# EAGLE design BFFL (EAGLE 6.5.0)
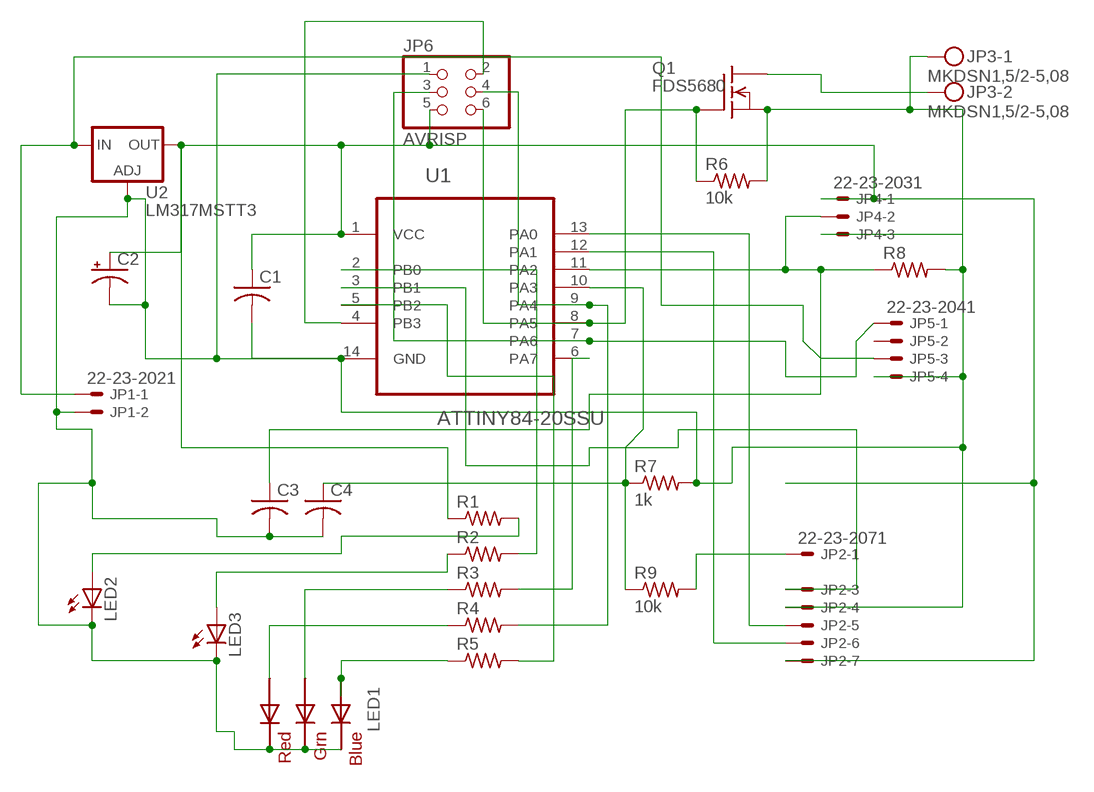
[diagram p0: schematic, sheet 1]

## Parts
C1  C-USC1206K  [C1206K]
C2  CPOL-USC/6032-28W  [C/6032-28W]
C3  C-USC1206K  [C1206K]
C4  C-USC1206K  [C1206K]
JP1  22-23-2021  [22-23-2021]
JP2  22-23-2071  [22-23-2071]
JP3  MKDSN1,5/2-5,08  [MKDSN1,5/2-5,08]
JP4  22-23-2031  [22-23-2031]
JP5  22-23-2041  [22-23-2041]
JP6  AVRISP  PINHD-2X3  [2X03]
LED1  RGBLED5050  [RGBLED5050]
LED2  LEDCHIPLED_1206  [CHIPLED_1206]
LED3  LEDCHIPLED_1206  [CHIPLED_1206]
Q1  FDS5680  [SO-8]
R1  R-US_R1206  [R1206]
R2  R-US_R1206  [R1206]
R3  R-US_R1206  [R1206]
R4  R-US_R1206  [R1206]
R5  R-US_R1206  [R1206]
R6  10k  R-US_R1206  [R1206]
R7  1k  R-US_R1206  [R1206]
R8  R-US_R1206  [R1206]
R9  10k  R-US_R1206  [R1206]
U1  ATTINY84-20SSU  [SOIC127P600X175-14N]
U2  LM317MSTT3  [SOT223]

## Nets
N$1: JP2.1 R9.2
N$2: C4.1 R7.1 R9.1 U1.10(PA3)
N$3: JP1.1 JP5.3 U2.3(IN)
N$4: JP6.6 Q1.4(G) R6.1 U1.8(PA5)
N$5: R2.2 U1.2(PB0)
N$6: C1.1 C2.+ JP2.7 JP4.1 JP6.5 R1.1 U1.1(VCC) U2.4(OUT)
N$7: LED2.A R1.2
N$8: LED3.A R2.1
N$9: LED1.2(RED_A) R4.1
N$10: LED1.1(GREEN_A) R3.1
N$11: LED1.3(BLUE_A) R5.1
N$12: JP3.2 Q1.5(D) Q1.6(D) Q1.7(D) Q1.8(D)
N$13: C1.2 C2.- C3.2 C4.2 JP1.2 JP2.4 JP3.1 JP4.3 JP5.4 JP6.1 LED1.4(BLUE_C) LED1.5(RED_C) LED1.6(GREEN_C) LED2.C LED3.C Q1.1(S) Q1.2(S) Q1.3(S) R6.2 R7.2 R8.2 U1.14(GND) U2.1(ADJ)
N$14: R5.2 U1.5(PB2)
N$15: R3.2 U1.6(PA7)
N$16: JP5.1 JP6.3 U1.7(PA6)
N$17: JP2.3 U1.3(PB1)
N$18: JP6.4 R4.2 U1.9(PA4)
N$19: C3.1 JP4.2 R8.1 U1.11(PA2)
N$21: JP2.5 U1.13(PA0)
N$22: JP2.6 U1.12(PA1)
N$24: JP6.2 U1.4(PB3)
Unconnected: JP2.2 JP5.2

## Library data of the parts
C1 C3 C4 = rcl:C-US: CAPACITOR, American symbol
C2 = rcl:CPOL-US: POLARIZED CAPACITOR, American symbol
JP1 = con-molex:22-23-2021: .100" (2.54mm) Center Header - 2 Pin; MF: MOLEX; MPN: 22-23-2021; OC_FARNELL: 1462926; OC_NEWARK: 25C3832
JP2 = con-molex:22-23-2071: .100" (2.54mm) Center Header - 7 Pin; MF: MOLEX; MPN: 22-23-2071; OC_FARNELL: 1654534; OC_NEWARK: 56H0445
JP3 = con-phoenix-508:MKDSN1,5/2-5,08: MKDSN 1,5/ 2-5,08 Printklemme Nennstrom: 13,5 A Nennspannung: 250 V Rastermaß: 5,08 mm Polzahl: 2 Anschlussart: Schraubanschluss Montage: Löten Anschlussrichtung Leiter/Platine: 0 ° Artikelnummer: 1729128 Source: http://eshop.phoenixcontact.com .. 1729128.pdf; MPN: MKDSN 1,5/2-5.08; OC_FARNELL: 1792903; OC_NEWARK: 30M2397
JP4 = con-molex:22-23-2031: .100" (2.54mm) Center Header - 3 Pin; MF: MOLEX; MPN: 22-23-2031; OC_FARNELL: 1462950; OC_NEWARK: 30C0862
JP5 = con-molex:22-23-2041: .100" (2.54mm) Center Header - 4 Pin; MF: MOLEX; MPN: 22-23-2041; OC_FARNELL: 1462920; OC_NEWARK: 38C0355
JP6 = pinhead:PINHD-2X3: PIN HEADER
LED1 = adafruit:RGBLED: For 5050 RGB LEDs, the order of the LEDs may vary from one manufacturer to another!
LED2 LED3 = led:LED: LED OSRAM: - CHIPLED LG R971, LG N971, LY N971, LG Q971, LY Q971, LO R971, LY R971 LH N974, LH R974 LS Q976, LO Q976, LY Q976 LO Q996 - Hyper CHIPLED LW Q18S LB Q993, LB Q99A, LB R99A - SideLED LS A670, LO A670, LY A670, LG A670, LP A670 LB A673, LV A673, LT A673, LW A673 LH A674 LY A675 LS A676, LA A676, LO A676, LY A676, LW A676 LS A679, LY A679, LG A679 - Hyper Micro SIDELED® LS Y876, LA Y876, LO Y876, LY Y876 LT Y87S - SmartLED LW L88C, LW L88S LB L89C, LB L89S, LG L890 LS L89K, LO L89K, LY L89K LS L896, LA L896, LO L896, LY L896 - TOPLED LS T670, LO T670, LY T670, LG T670, LP T670 LSG T670, LSP T670, LSY T670, LOP T670, LYG T670 LG T671, LOG T671, LSG T671 LB T673, LV T673, LT T673, LW T673 LH T674 LS T676, LA T676, LO T676, LY T676, LB T676, LH T676, LSB T676, LW T676 LB T67C, LV T67C, LT T67C, LS T67K, LO T67K, LY T67K, LW E67C LS E67B, LA E67B, LO E67B, LY E67B, LB E67C, LV E67C, LT E67C LW T67C LS T679, LY T679, LG T679 LS T770, LO T770, LY T770, LG T770, LP T770 LB T773, LV T773, LT T773, LW T773 LH T774 LS E675, LA E675, LY E675, LS T675 LS T776, LA T776, LO T776, LY T776, LB T776 LHGB T686 LT T68C, LB T68C - Hyper Mini TOPLED® LB M676 - Mini TOPLED Santana® LG M470 LS M47K, LO M47K, LY M47K Source: http://www.osram.convergy.de LUXEON: - LUMILED® LXK2-PW12-R00, LXK2-PW12-S00, LXK2-PW14-U00, LXK2-PW14-V00 LXK2-PM12-R00, LXK2-PM12-S00, LXK2-PM14-U00 LXK2-PE12-Q00, LXK2-PE12-R00, LXK2-PE12-S00, LXK2-PE14-T00, LXK2-PE14-U00 LXK2-PB12-K00, LXK2-PB12-L00, LXK2-PB12-M00, LXK2-PB14-N00, LXK2-PB14-P00, LXK2-PB14-Q00 LXK2-PR12-L00, LXK2-PR12-M00, LXK2-PR14-Q00, LXK2-PR14-R00 LXK2-PD12-Q00, LXK2-PD12-R00, LXK2-PD12-S00 LXK2-PH12-R00, LXK2-PH12-S00 LXK2-PL12-P00, LXK2-PL12-Q00, LXK2-PL12-R00 Source: www.luxeon.com KINGBRIGHT: KA-3528ASYC Source: www.kingbright.com
Q1 = transistor-fet:FDS5680: 60V N-Channel PowerTrench TM MOSFET FAIRCHILD FDS5680.pdf
R1-R9 = rcl:R-US_: RESISTOR, American symbol
U1 = Atmel_By_element14_Batch_1:ATTINY84-20SSU: 8-bit Microcontroller with Bytes In-System Programmable Flash; MPN: ATTINY84-20SSU; OC_FARNELL: 1636955; OC_NEWARK: 03P2040; PACKAGE: SOIC-14; SUPPLIER: Atmel
U2 = v-reg:LM317?*: 500 mA Adjustable Output Positive Voltage Regulator Source: http://www.onsemi.co.jp .. LM317M-D.PDF

## Board
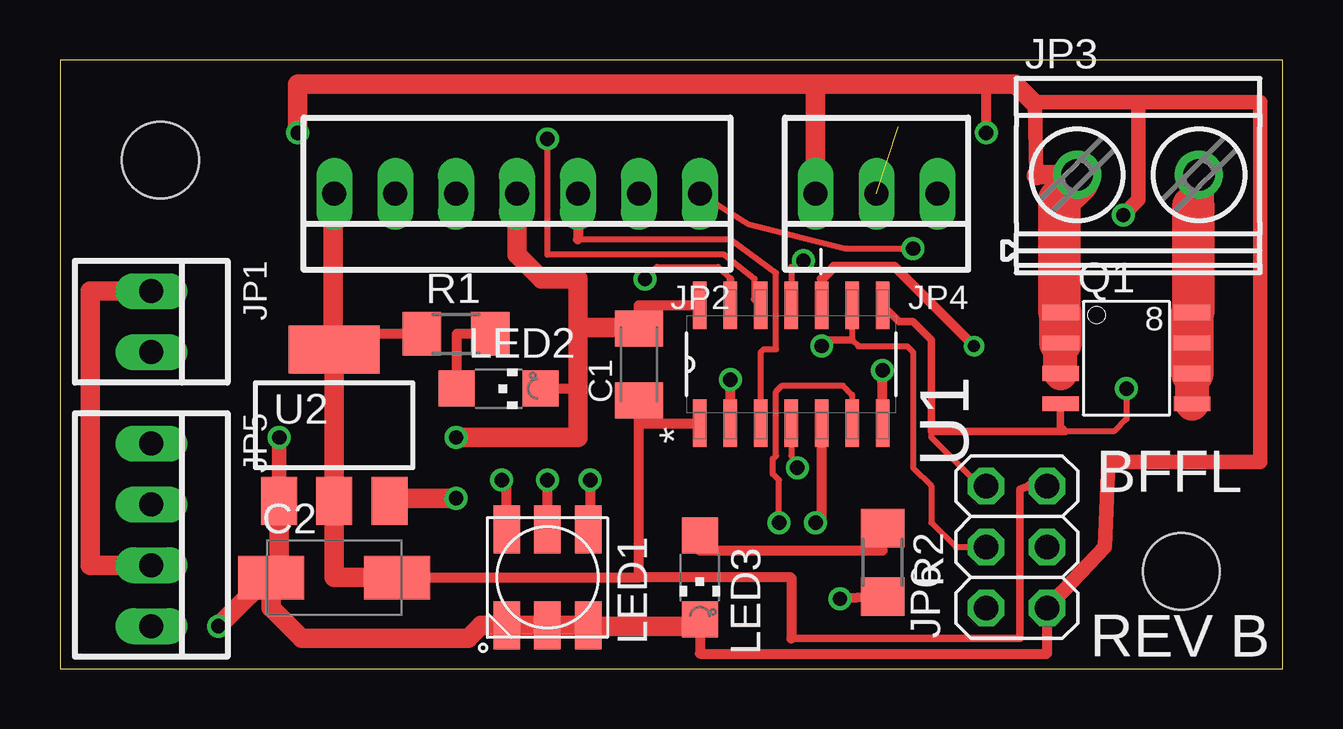
[diagram p1: board, top side]
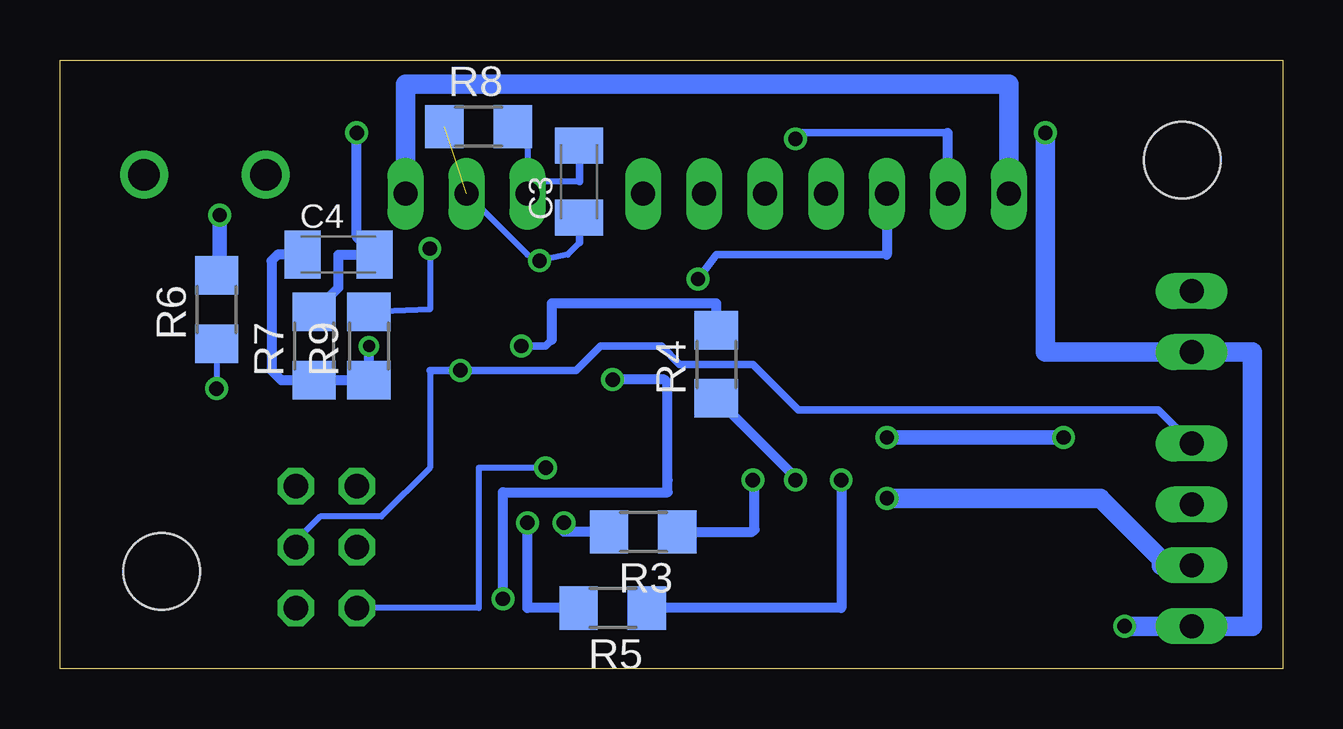
[diagram p2: board, bottom side, seen from below]

Size 50.98 x 25.39 mm. Coordinates in mm from the lower left corner, seen from the top.
Outline: 0,0 50.98,0 50.98,25.39 0,25.39 0,0
Copper layers (1*16): Top 0.0356mm / dielectric 1.5011mm / Bottom 0.0356mm
Design rules "LaenPCBOrder": minimum track width 6mil, minimum drill 13mil, track to track 6mil, track to pad 6mil, pad to pad 6mil, via to via 6mil, smd to smd 6mil, copper to edge 15mil, drill to drill 6mil, minimum pad ring 7mil, minimum via ring 7mil, stop-mask expansion 3mil, vias tented up to drill 0mil, thermal gap 10mil
Holes 3.2 mm at 4.19,21.21 46.74,4.06

### Footprints (pad centres in the part's own frame; a part is rotated, then mirrored left to right if it is on the bottom)
C1206K = smd 1.5 x 2: 1 -1.5,0; 2 1.5,0
C/6032-28W = smd 2.75 x 1.8: + 2.625,0; - -2.625,0
22-23-2021 = drill 1 long: 1 -1.27,0; 2 1.27,0
22-23-2071 = drill 1 long: 1 -7.62,0; 2 -5.08,0; 3 -2.54,0; 4 0,0; 5 2.54,0; 6 5.08,0; 7 7.62,0
MKDSN1,5/2-5,08 = drill 1.3 pad 2: 1 -2.561,0.025; 2 2.519,0.025
22-23-2031 = drill 1 long: 1 -2.54,0; 2 0,0; 3 2.54,0
22-23-2041 = drill 1 long: 1 -3.81,0; 2 -1.27,0; 3 1.27,0; 4 3.81,0
2X03 = drill 1.016 octagon: 1 -2.54,-1.27; 2 -2.54,1.27; 3 0,-1.27; 4 0,1.27; 5 2.54,-1.27; 6 2.54,1.27
RGBLED5050 = smd 2 x 1.1: 1 -2,1.7; 2 -2,0; 3 -2,-1.7; 4 2,-1.7; 5 2,0; 6 2,1.7
CHIPLED_1206 = smd 1.5 x 1.5: A 0,-1.75; C 0,1.75
SO-8 = smd 1.524 x 0.61: 1 -2.743,1.905; 2 -2.743,0.635; 3 -2.743,-0.635; 4 -2.743,-1.905; 5 2.743,-1.905; 6 2.743,-0.635; 7 2.743,0.635; 8 2.743,1.905
R1206 = smd 1.6 x 1.803: 1 -1.422,0; 2 1.422,0
SOIC127P600X175-14N = smd 1.981 x 0.559: 1 -2.464,3.81; 2 -2.464,2.54; 3 -2.464,1.27; 4 -2.464,0; 5 -2.464,-1.27; 6 -2.464,-2.54; 7 -2.464,-3.81; 8 2.464,-3.81; 9 2.464,-2.54; 10 2.464,-1.27; 11 2.464,0; 12 2.464,1.27; 13 2.464,2.54; 14 2.464,3.81
SOT223 = smd 1.5 x 2: 1 -2.3,-3.15; 2 0,-3.15; 3 2.3,-3.15 | smd 3.8 x 2: 4 0,3.15

### Placement (x,y rotation side)
C1  24.13,12.7 90 top
C2  11.43,3.81 0 top
C3  29.34,20.32 90 bottom
C4  39.37,17.27 0 bottom
JP1  3.81,14.48 270 top
JP2  19.05,19.81 180 top
JP3  44.96,20.57 0 top
JP4  34.04,19.81 180 top
JP5  3.81,5.59 270 top
JP6  39.88,5.08 90 top
LED1  20.32,3.81 270 top
LED2  18.29,11.68 270 top
LED3  26.67,3.81 180 top
Q1  44.45,12.95 0 top
R1  16.51,13.97 0 top
R2  34.29,4.45 270 top
R3  26.67,5.71 180 bottom
R4  23.62,12.7 90 bottom
R5  27.94,2.54 180 bottom
R6  44.45,14.99 90 bottom
R7  40.39,13.46 90 bottom
R8  33.53,22.61 0 bottom
R9  38.1,13.46 90 bottom
U1  30.48,12.7 90 top
U2  11.43,10.16 0 top

### Tracks (layer width: path | path; a pad name or v marks a point on that pad's centre or on a via)
N$1  (via drill 0.6)
  Top 0.254: JP2.1 28.7,18.54 32.77,17.53 v35.56,17.53
  Bottom 0.254: v35.56,17.53 35.56,14.99 R9.2
N$2  (via drill 0.5)
  Top 0.406: v38.1,13.46 34.8,16.76 32.26,16.76 31.75,16.26 U1.10
  Bottom 0.406: C4.1 41.91,17.27 42.16,17.02 42.16,12.45 41.76,12.04 R7.1 R9.1 v38.1,13.46
N$3  (via drill 0.6)
  Top 0.813: JP1.1 1.27,15.75 1.27,4.32 JP5.3 | v16.51,7.11 13.83,7.11 U2.3
  Bottom 0.813: JP5.3 5.08,4.32 5.08,4.57 7.62,7.11 v16.51,7.11
N$4  (via drill 0.6)
  Top 0.254: v44.45,11.68 44.45,10.41 43.94,9.91 41.91,9.91 | JP6.6 38.35,7.62 36.32,9.65 36.32,9.91
  Top 0.305: U1.8 34.98,14.48 35.56,14.48 36.32,13.72 36.32,9.91 41.91,9.91 41.71,10.11 Q1.4
  Bottom 0.254: R6.1 v44.45,11.68
N$5  (via drill 0.6)
  Top 0.406: U1.2 v27.94,12.06 | R2.2 v32.51,2.92
  Bottom 0.406: v32.51,2.92 32.51,7.37 25.65,7.37 25.65,7.87 25.65,11.94 25.78,12.06 v27.94,12.06
N$6
  Top 0.305: 40.39,7.62 40.01,7.49 40.01,1.27 30.48,1.27
  Top 0.406: U1.1 24.13,10.24 C1.1 24.13,3.81 | 11.33,16 11.39,13.98 11.43,12.7 | C2.+ 24.13,3.81 | 24.13,3.81 30.48,3.81 30.48,1.27 | R1.1 11.43,13.97 | JP6.5 40.39,7.62
  Top 0.813: C2.+ 11.43,3.81 11.43,12.7 U2.4 11.43,13.97 | JP2.7 11.39,19.77 11.39,13.98
  Bottom 0.813: 36.58,20.45 JP4.1 36.58,24.38 11.43,24.38 JP2.7
N$7
  Top 0.406: R1.2 16.54,13.97 LED2.A
N$8
  Top 0.406: R2.1 34.29,4.92 26.67,4.92 LED3.A
N$9  (via drill 0.6)
  Top 0.406: LED1.2 v20.32,7.87
  Bottom 0.406: v20.32,7.87 20.32,7.98 R4.1
N$10  (via drill 0.6)
  Top 0.406: v22.1,7.87 22.1,5.89 LED1.1
  Bottom 0.406: R3.1 22.12,5.71 LED1.1 22.02,7.8 v22.1,7.87
N$11  (via drill 0.6)
  Top 0.406: LED1.3 18.62,7.87 18.5,7.87 v18.41,7.87
  Bottom 0.406: v18.41,7.87 18.41,2.54 R5.1
N$12
  Top 1.27: Q1.8 47.24,14.91 | 47.24,19.3 47.48,19.54 JP3.2
  Top 1.422: Q1.5 Q1.6
  Top 1.778: Q1.6 Q1.7 Q1.8 | 47.24,14.91 47.24,19.3
N$13  (via drill 0.6)
  Top 0.406: C1.2 24.13,15.16 U1.14 | LED3.C 26.67,1.81 | v38.61,22.35 38.61,24.38 | LED2.C 21.59,11.68 | 26.67,1.52 26.67,0.64 41.15,0.64 JP6.1
  Top 0.61: 40.69,20.57 40.64,23.57 40.64,23.62 44.96,23.62 | 44.96,23.62 50.04,23.62 50.04,8.64 43.69,8.64 43.56,5.08 JP6.1 | U2.1 9.14,7.02 v9.14,9.65 | v44.32,18.92 44.96,19.56 44.96,23.62
  Top 0.813: 9.13,4.3 9.13,3.81 C2.- 8.8,2.54 10.08,1.27 17.02,1.27 17.56,1.81 LED1.4 LED1.5 LED1.6 22.05,1.78 26.16,1.78 26.19,1.81 26.67,1.81 | 9.13,4.3 U2.1 | v16.51,9.65 21.59,9.65 21.59,11.68 21.59,14.22 | 21.59,14.22 24.11,14.22 C1.2 | 21.59,14.22 21.59,16.26 20.07,16.26 19.05,17.27 JP2.4 | 40.69,20.57 40.72,20.6 JP3.1 | 40.64,23.57 39.83,24.38 38.61,24.38 31.5,24.38 | 31.5,24.38 9.91,24.38 v9.91,22.35 | v6.6,1.78 9.13,4.3 | 31.5,24.38 JP4.3
  Top 1.422: Q1.3 Q1.2
  Top 1.778: Q1.2 Q1.1 41.66,14.91 41.66,19.56 42.4,20.3 JP3.1
  Bottom 0.254: 31.62,22.38 R8.2 31.5,22 31.5,20.32 | 31.5,20.32 JP4.3 | 29.31,20.32 31.5,20.32
  Bottom 0.305: C3.2 29.31,20.32
  Bottom 0.406: R7.2 39.37,15.9 39.37,17.27 C4.2 38.61,18.01 v38.61,22.35
  Bottom 0.61: v9.14,9.65 v16.51,9.65 | R6.2 44.32,16.54 v44.32,18.92
  Bottom 0.813: v9.91,22.35 9.91,13.21 JP1.2 1.27,13.21 1.27,1.78 JP5.4 v6.6,1.78
N$14  (via drill 0.6)
  Top 0.406: v31.5,6.1 31.75,6.1 U1.5
  Bottom 0.406: R5.2 31.5,2.54 v31.5,6.1
N$15  (via drill 0.6)
  Top 0.254: v29.97,6.1 29.97,7.87 29.72,8.13 29.72,8.76 29.84,8.89 29.84,11.56 30.1,11.81 32.64,11.81 33.02,11.43 U1.6
  Bottom 0.406: R3.2 29.97,5.71 v29.97,6.1
N$16  (via drill 0.6)
  Top 0.406: U1.7 v34.29,12.45
  Bottom 0.254: 35.56,12.45 35.56,8.38 37.59,6.35 40.13,6.35 41.4,5.08 JP6.3
  Bottom 0.305: 35.56,12.45 v34.29,12.45 29.46,12.45 28.45,13.46 25.91,13.46 25.15,12.7 22.1,12.7 20.19,10.79 5.21,10.79 JP5.1
N$17
  Top 0.254: U1.3 29.21,13.21 29.34,13.34 29.84,13.34 29.84,16.51 27.94,17.91 21.59,17.91
  Top 0.406: JP2.3 21.59,17.91
N$18  (via drill 0.6)
  Top 0.254: U1.9 33.02,13.72 33.27,13.46 35.31,13.46 35.56,13.21 35.56,8.38 36.32,7.62 36.32,6.1 37.34,5.08 JP6.4
  Top 0.305: v31.75,13.46 32,13.72 33.02,13.72
  Bottom 0.305: 30.48,13.72 30.73,13.46 v31.75,13.46
  Bottom 0.406: 30.48,13.72 30.48,15.24 23.62,15.24 R4.2
N$19  (via drill 0.6)  (1 unrouted)
  Top 0.254: v30.99,17.02 30.48,16.76 U1.11
  Bottom 0.254: R8.1 35.05,22.76 | 29.31,17.78 29.82,17.27 v30.99,17.02 31.5,17.27 JP4.2
  Bottom 0.305: C3.1 29.31,17.78
N$21  (via drill 0.6)
  Top 0.254: v24.38,16.26 24.89,16.76 27.43,16.76 27.94,16.26
  Top 0.305: 27.94,14.73 U1.13 27.94,16.26
  Bottom 0.305: v24.38,16.26 23.62,17.27 16.51,17.27
  Bottom 0.406: JP2.5 16.51,17.27
N$22  (via drill 0.6)
  Top 0.254: 28.96,15.42 28.96,16.26 27.69,17.27 20.32,17.27 v20.32,22.1
  Top 0.305: U1.12 28.96,15.42
  Bottom 0.305: v20.32,22.1 20.07,22.35 13.97,22.35
  Bottom 0.406: JP2.6 13.97,22.35
N$24  (via drill 0.6)
  Top 0.254: 30.48,10.16 30.48,8.89 v30.73,8.38
  Top 0.406: U1.4 30.48,10.16
  Bottom 0.254: v30.73,8.38 33.53,8.38 33.53,2.54 JP6.2

### Text on the board
tSilk: BFFL | REV B